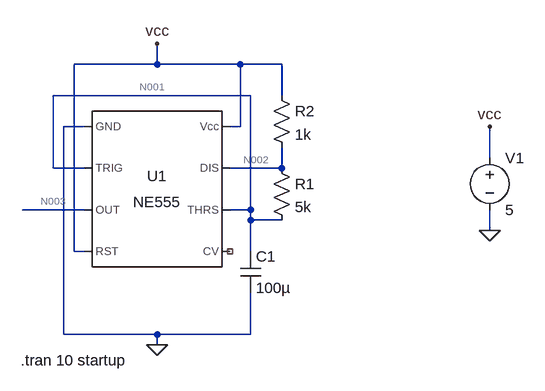
[diagram p0: schematic Draft1.asc]
Draft1.asc, the LTspice schematic file:
Version 4
SHEET 1 880 680
WIRE 208 -16 208 -48
WIRE 208 -16 80 -16
WIRE 336 -16 208 -16
WIRE 400 -16 336 -16
WIRE 352 32 48 32
WIRE 400 32 400 -16
WIRE 96 80 64 80
WIRE 336 80 336 -16
WIRE 336 80 320 80
WIRE 720 128 720 80
WIRE 48 144 48 32
WIRE 96 144 48 144
WIRE 400 144 400 112
WIRE 400 144 320 144
WIRE 96 208 0 208
WIRE 352 208 352 32
WIRE 352 208 320 208
WIRE 352 224 352 208
WIRE 400 224 352 224
WIRE 720 240 720 208
WIRE 80 272 80 -16
WIRE 96 272 80 272
WIRE 352 272 352 224
WIRE 64 400 64 80
WIRE 208 400 64 400
WIRE 352 400 352 336
WIRE 352 400 208 400
WIRE 208 416 208 400
FLAG 720 240 0
FLAG 208 416 0
FLAG 720 80 vcc
FLAG 208 -48 vcc
SYMBOL Misc\\NE555 208 176 R0
SYMATTR InstName U1
SYMBOL voltage 720 112 R0
WINDOW 123 0 0 Left 0
WINDOW 39 0 0 Left 0
SYMATTR InstName V1
SYMATTR Value 5
SYMBOL cap 336 272 R0
SYMATTR InstName C1
SYMATTR Value 100µ
SYMBOL res 384 128 R0
SYMATTR InstName R1
SYMATTR Value 5k
SYMBOL res 384 16 R0
SYMATTR InstName R2
SYMATTR Value 1k
TEXT -2 440 Left 2 !.tran 10 startup

The netlist it stands for:
* Draft1.asc
XU1 0 N001 N003 vcc NC_01 N001 N002 vcc NE555  ; pins GND TRIG OUT RST CV THRS DIS Vcc
V1 vcc 0 5
C1 N001 0 100µ
R1 N002 N001 5k
R2 vcc N002 1k
.tran 10 startup
.lib NE555.sub
.backanno
.end

* Results of the author's LTspice run, read from the files saved beside the schematic
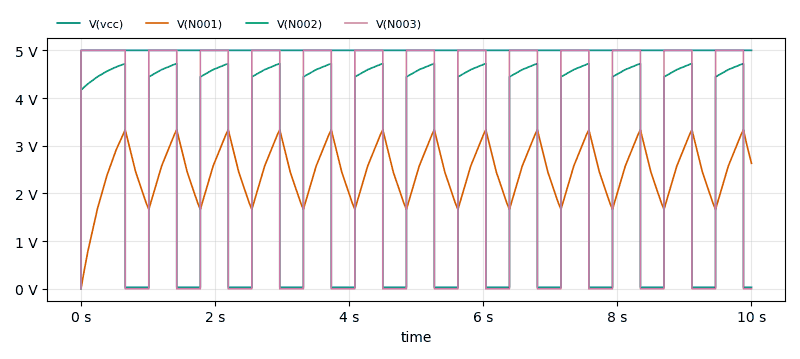
[diagram p1: Transient Analysis of Draft1.asc, plotted from the saved traces]
* Transient Analysis, 1 run:
*   V(vcc): min 0 V, max 5 V, average 5 V, rms 5 V, last 5 V
*   V(N001): min 0 V, max 3.334 V, average 2.475 V, rms 2.553 V, last 2.631 V
*   V(N002): min 0 V, max 4.722 V, average 2.607 V, rms 3.449 V, last 32.92 mV
*   V(N003): min 0 V, max 5 V, average 2.828 V, rms 3.761 V, last 30 µV